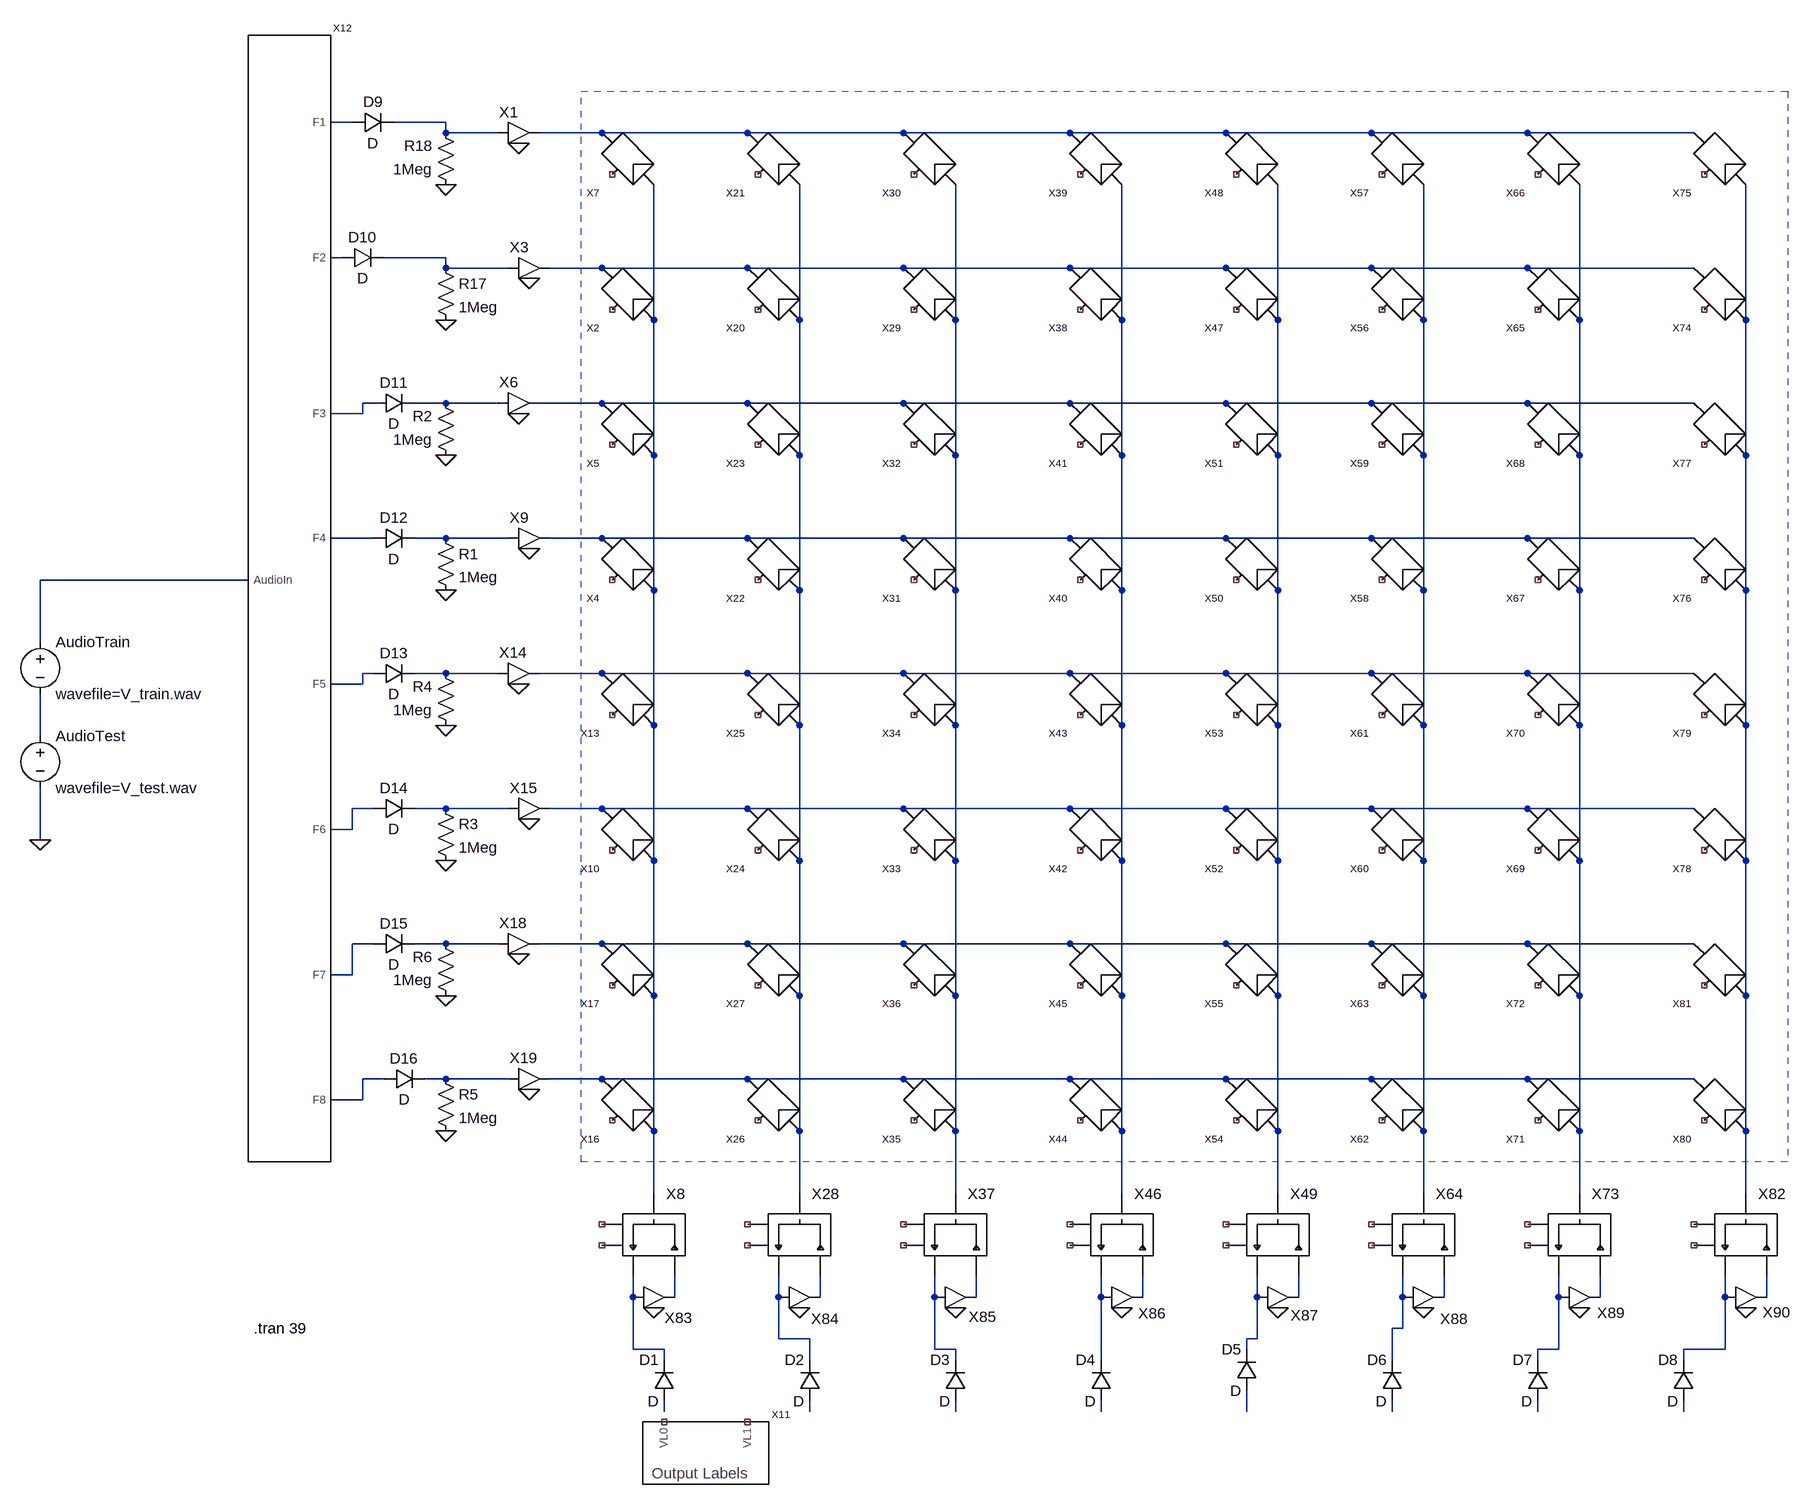
[diagram p0: schematic Net Array.asc]
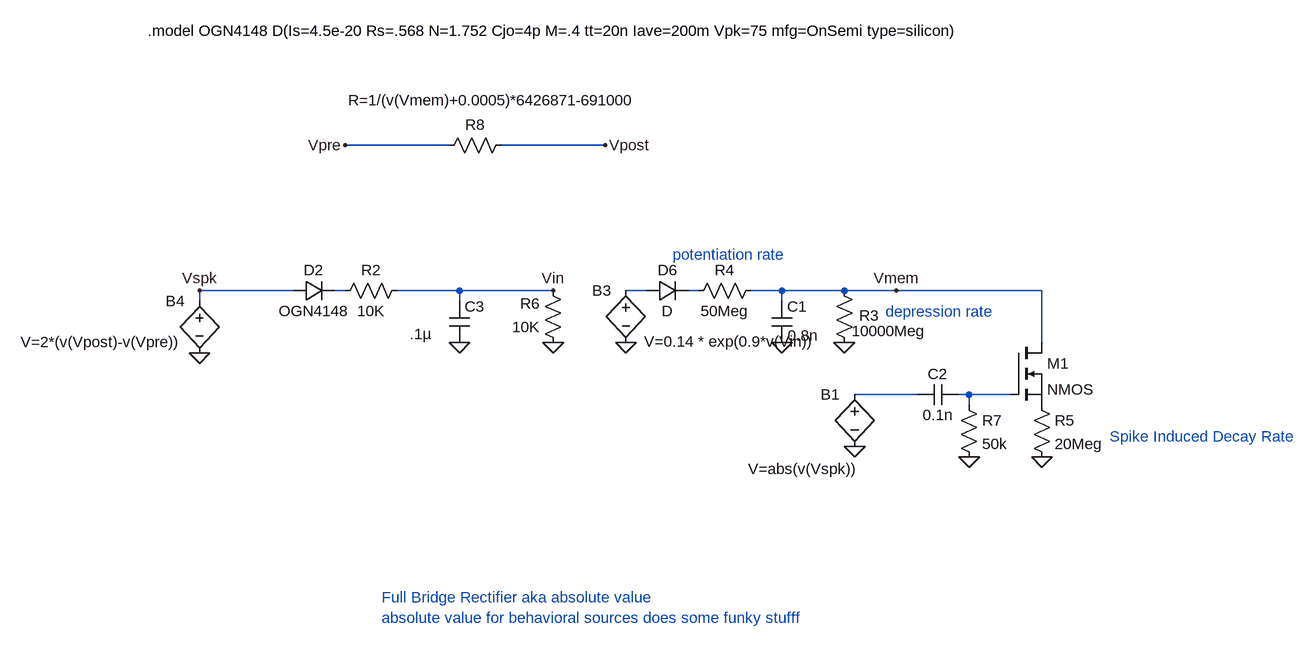
[diagram p1: sub-circuit synapse.asc]
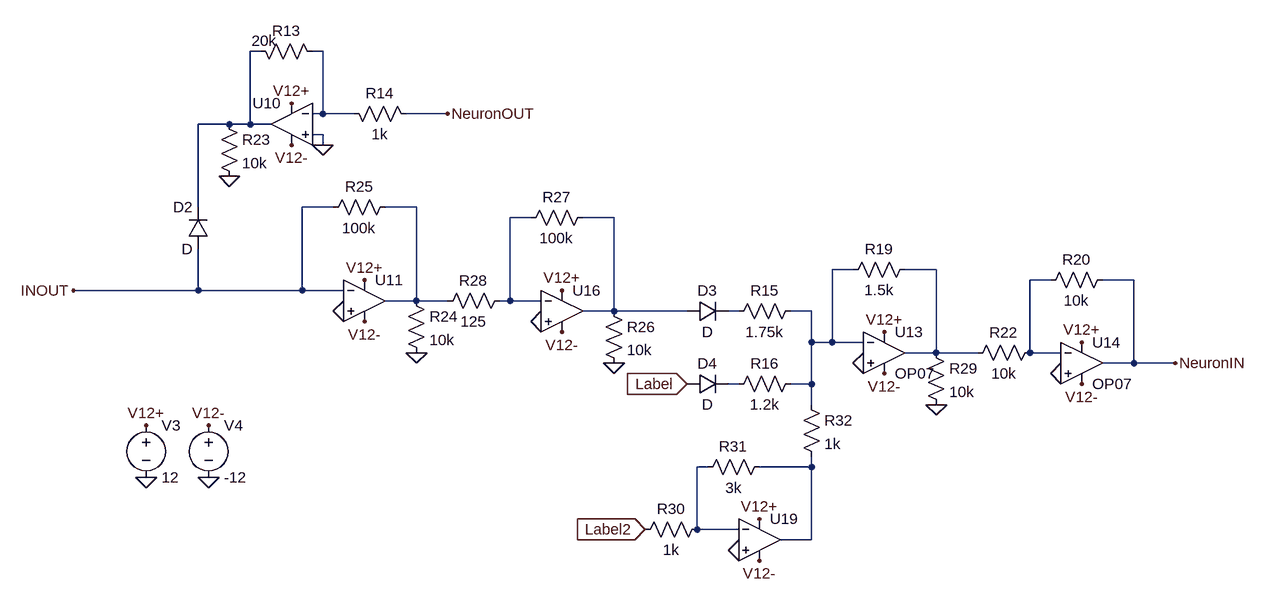
[diagram p2: sub-circuit bidirectionlamp.asc]
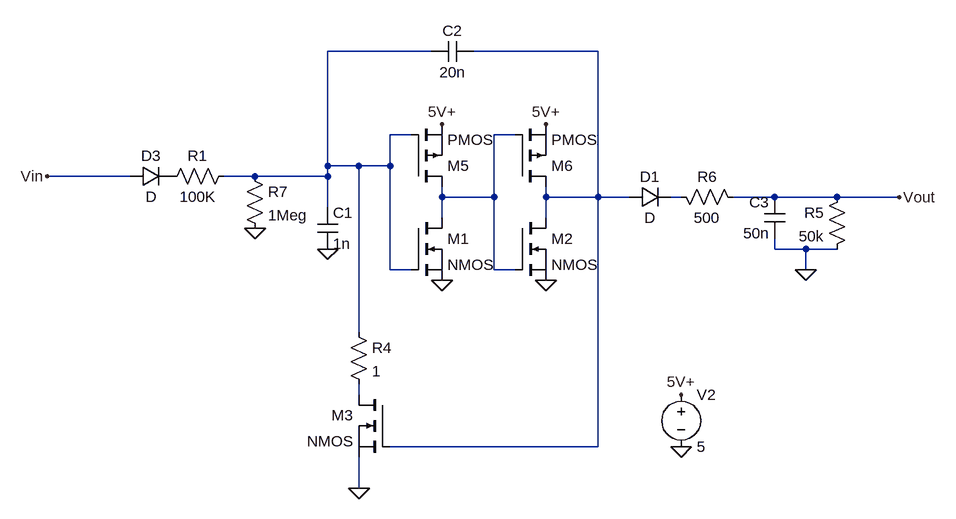
[diagram p3: sub-circuit ahp.asc]
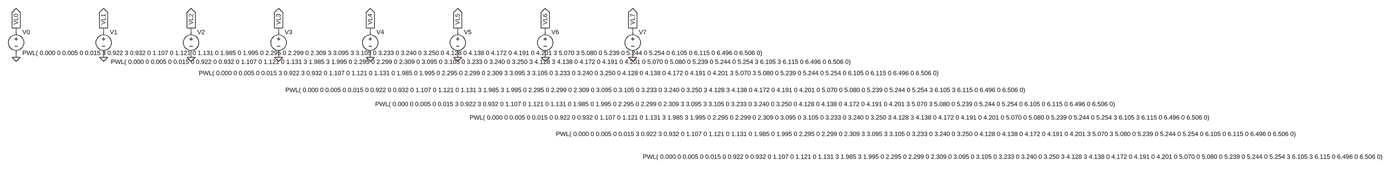
[diagram p4: sub-circuit outputlabels.asc, whole sheet]
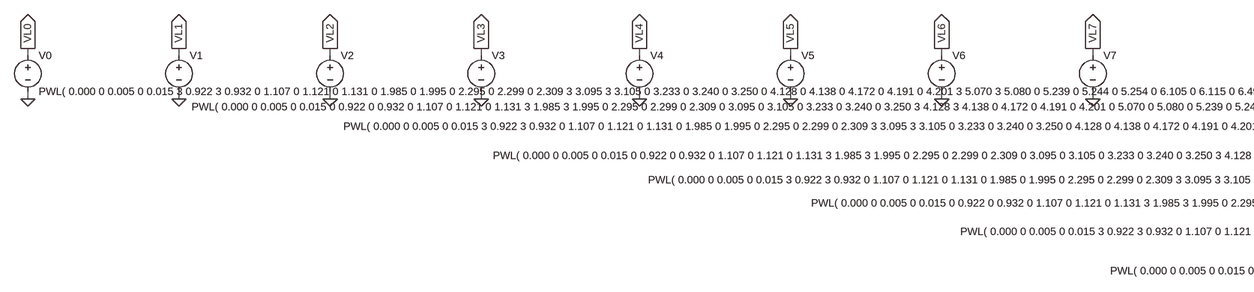
[diagram p5: sub-circuit outputlabels.asc, part, row 1 of 1, column 1 of 2]
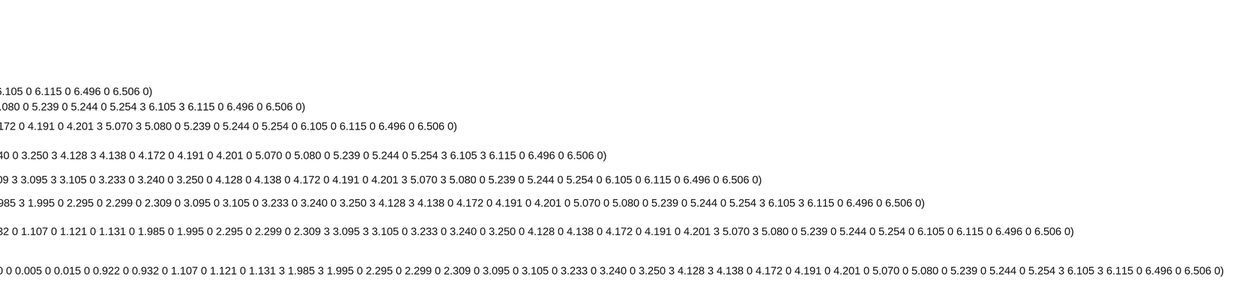
[diagram p6: sub-circuit outputlabels.asc, part, row 1 of 1, column 2 of 2]
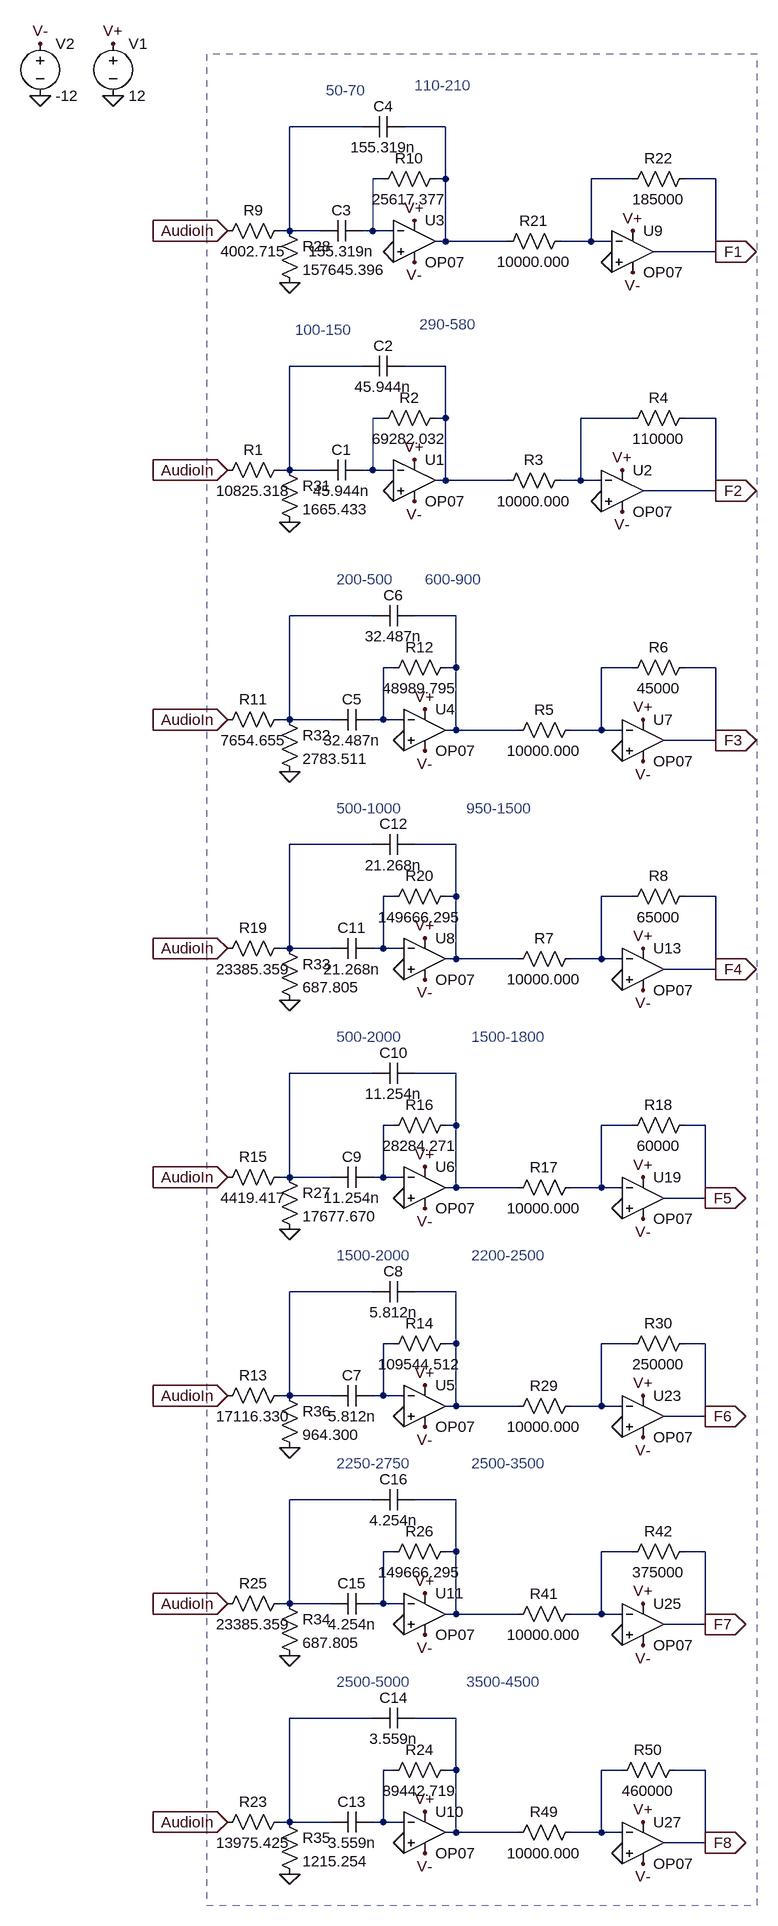
[diagram p7: sub-circuit filterbank.asc]
Net Array.asc, the LTspice schematic file:
Version 4
SHEET 1 2160 1096
WIRE -64 -1024 -96 -1024
WIRE 80 -1024 0 -1024
WIRE 80 -1008 80 -1024
WIRE 160 -1008 80 -1008
WIRE 320 -1008 224 -1008
WIRE 544 -1008 320 -1008
WIRE 784 -1008 544 -1008
WIRE 1040 -1008 784 -1008
WIRE 1280 -1008 1040 -1008
WIRE 1504 -1008 1280 -1008
WIRE 1744 -1008 1504 -1008
WIRE 2000 -1008 1744 -1008
WIRE -80 -816 -96 -816
WIRE 80 -816 -16 -816
WIRE 80 -800 80 -816
WIRE 176 -800 80 -800
WIRE 320 -800 240 -800
WIRE 544 -800 320 -800
WIRE 784 -800 544 -800
WIRE 1040 -800 784 -800
WIRE 1280 -800 1040 -800
WIRE 1504 -800 1280 -800
WIRE 1744 -800 1504 -800
WIRE 2000 -800 1744 -800
WIRE 400 -720 400 -928
WIRE 624 -720 624 -928
WIRE 864 -720 864 -928
WIRE 1120 -720 1120 -928
WIRE 1360 -720 1360 -928
WIRE 1584 -720 1584 -928
WIRE 1824 -720 1824 -928
WIRE 2080 -720 2080 -928
WIRE -32 -592 -48 -592
WIRE 80 -592 32 -592
WIRE 160 -592 80 -592
WIRE 320 -592 224 -592
WIRE 544 -592 320 -592
WIRE 784 -592 544 -592
WIRE 1040 -592 784 -592
WIRE 1280 -592 1040 -592
WIRE 1504 -592 1280 -592
WIRE 1744 -592 1504 -592
WIRE 2000 -592 1744 -592
WIRE -48 -576 -48 -592
WIRE -48 -576 -96 -576
WIRE 400 -512 400 -720
WIRE 624 -512 624 -720
WIRE 864 -512 864 -720
WIRE 1120 -512 1120 -720
WIRE 1360 -512 1360 -720
WIRE 1584 -512 1584 -720
WIRE 1824 -512 1824 -720
WIRE 2080 -512 2080 -720
WIRE -32 -384 -96 -384
WIRE 80 -384 32 -384
WIRE 176 -384 80 -384
WIRE 320 -384 240 -384
WIRE 544 -384 320 -384
WIRE 784 -384 544 -384
WIRE 1040 -384 784 -384
WIRE 1280 -384 1040 -384
WIRE 1504 -384 1280 -384
WIRE 1744 -384 1504 -384
WIRE 2000 -384 1744 -384
WIRE -224 -320 -544 -320
WIRE 400 -304 400 -512
WIRE 624 -304 624 -512
WIRE 864 -304 864 -512
WIRE 1120 -304 1120 -512
WIRE 1360 -304 1360 -512
WIRE 1584 -304 1584 -512
WIRE 1824 -304 1824 -512
WIRE 2080 -304 2080 -512
WIRE -544 -224 -544 -320
WIRE -32 -176 -48 -176
WIRE 80 -176 32 -176
WIRE 160 -176 80 -176
WIRE 320 -176 224 -176
WIRE 544 -176 320 -176
WIRE 784 -176 544 -176
WIRE 1040 -176 784 -176
WIRE 1280 -176 1040 -176
WIRE 1504 -176 1280 -176
WIRE 1744 -176 1504 -176
WIRE 2000 -176 1744 -176
WIRE -48 -160 -48 -176
WIRE -48 -160 -96 -160
WIRE 400 -96 400 -304
WIRE 624 -96 624 -304
WIRE 864 -96 864 -304
WIRE 1120 -96 1120 -304
WIRE 1360 -96 1360 -304
WIRE 1584 -96 1584 -304
WIRE 1824 -96 1824 -304
WIRE 2080 -96 2080 -304
WIRE -544 -80 -544 -144
WIRE -32 32 -64 32
WIRE 80 32 32 32
WIRE 176 32 80 32
WIRE 320 32 240 32
WIRE 544 32 320 32
WIRE 784 32 544 32
WIRE 1040 32 784 32
WIRE 1280 32 1040 32
WIRE 1504 32 1280 32
WIRE 1744 32 1504 32
WIRE 2000 32 1744 32
WIRE -64 64 -64 32
WIRE -64 64 -96 64
WIRE -544 80 -544 0
WIRE 400 112 400 -96
WIRE 624 112 624 -96
WIRE 864 112 864 -96
WIRE 1120 112 1120 -96
WIRE 1360 112 1360 -96
WIRE 1584 112 1584 -96
WIRE 1824 112 1824 -96
WIRE 2080 112 2080 -96
WIRE -32 240 -64 240
WIRE 80 240 32 240
WIRE 160 240 80 240
WIRE 320 240 224 240
WIRE 544 240 320 240
WIRE 784 240 544 240
WIRE 1040 240 784 240
WIRE 1280 240 1040 240
WIRE 1504 240 1280 240
WIRE 1744 240 1504 240
WIRE 2000 240 1744 240
WIRE -64 288 -64 240
WIRE -64 288 -96 288
WIRE 400 320 400 112
WIRE 624 320 624 112
WIRE 864 320 864 112
WIRE 1120 320 1120 112
WIRE 1360 320 1360 112
WIRE 1584 320 1584 112
WIRE 1824 320 1824 112
WIRE 2080 320 2080 112
WIRE -16 448 -48 448
WIRE 80 448 48 448
WIRE 176 448 80 448
WIRE 320 448 240 448
WIRE 544 448 320 448
WIRE 784 448 544 448
WIRE 1040 448 784 448
WIRE 1280 448 1040 448
WIRE 1504 448 1280 448
WIRE 1744 448 1504 448
WIRE 2000 448 1744 448
WIRE -48 480 -48 448
WIRE -48 480 -96 480
WIRE 400 528 400 320
WIRE 624 528 624 320
WIRE 864 528 864 320
WIRE 1120 528 1120 320
WIRE 1360 528 1360 320
WIRE 1584 528 1584 320
WIRE 1824 528 1824 320
WIRE 2080 528 2080 320
WIRE 400 624 400 528
WIRE 624 624 624 528
WIRE 864 624 864 528
WIRE 1120 624 1120 528
WIRE 1360 624 1360 528
WIRE 1584 624 1584 528
WIRE 1824 624 1824 528
WIRE 2080 624 2080 528
WIRE 368 784 368 752
WIRE 432 784 432 752
WIRE 592 784 592 752
WIRE 656 784 656 752
WIRE 832 784 832 752
WIRE 896 784 896 752
WIRE 1088 784 1088 752
WIRE 1152 784 1152 752
WIRE 1328 784 1328 752
WIRE 1392 784 1392 752
WIRE 1552 784 1552 752
WIRE 1616 784 1616 752
WIRE 1792 784 1792 752
WIRE 1856 784 1856 752
WIRE 2048 784 2048 752
WIRE 2112 784 2112 752
WIRE 1552 832 1552 784
WIRE 1552 832 1536 832
WIRE 592 848 592 784
WIRE 640 848 592 848
WIRE 1328 848 1328 784
WIRE 1328 848 1312 848
WIRE 368 864 368 784
WIRE 416 864 368 864
WIRE 832 864 832 784
WIRE 864 864 832 864
WIRE 1312 864 1312 848
WIRE 1792 864 1792 784
WIRE 1792 864 1760 864
WIRE 2048 864 2048 784
WIRE 2048 864 1984 864
WIRE 416 880 416 864
WIRE 640 880 640 848
WIRE 864 880 864 864
WIRE 1088 880 1088 784
WIRE 1536 880 1536 832
WIRE 1760 880 1760 864
WIRE 1984 880 1984 864
WIRE 416 960 416 944
WIRE 640 960 640 944
WIRE 864 960 864 944
WIRE 1088 960 1088 944
WIRE 1312 960 1312 928
WIRE 1536 960 1536 944
WIRE 1760 960 1760 944
WIRE 1984 960 1984 944
FLAG 80 -720 0
FLAG 80 -928 0
FLAG 192 -992 0
FLAG 208 -784 0
FLAG 80 -304 0
FLAG 80 -512 0
FLAG 192 -576 0
FLAG 208 -368 0
FLAG 80 112 0
FLAG 80 -96 0
FLAG 192 -160 0
FLAG 208 48 0
FLAG 80 528 0
FLAG 80 320 0
FLAG 192 256 0
FLAG 208 464 0
FLAG 400 800 0
FLAG 624 800 0
FLAG 864 800 0
FLAG 1120 800 0
FLAG 1360 800 0
FLAG 1584 800 0
FLAG 1824 800 0
FLAG 2080 800 0
FLAG -544 80 0
SYMBOL Synapse 400 -720 R180
SYMATTR InstName X2
SYMBOL Synapse 400 -928 R180
SYMATTR InstName X7
SYMBOL res 64 -816 R0
SYMATTR InstName R17
SYMATTR Value 1Meg
SYMBOL res 96 -912 R180
WINDOW 0 36 76 Left 2
WINDOW 3 36 40 Left 2
SYMATTR InstName R18
SYMATTR Value 1Meg
SYMBOL BiDirectionlAmp 400 688 R0
SYMATTR InstName X8
SYMBOL AHP 160 -1008 R0
SYMATTR InstName X1
SYMATTR SpiceLine Rinhibition = 1Meg
SYMBOL AHP 176 -800 R0
SYMATTR InstName X3
SYMATTR SpiceLine Rinhibition = 1Meg
SYMBOL Synapse 400 -304 R180
SYMATTR InstName X4
SYMBOL Synapse 400 -512 R180
SYMATTR InstName X5
SYMBOL res 64 -400 R0
SYMATTR InstName R1
SYMATTR Value 1Meg
SYMBOL res 96 -496 R180
WINDOW 0 36 76 Left 2
WINDOW 3 36 40 Left 2
SYMATTR InstName R2
SYMATTR Value 1Meg
SYMBOL AHP 160 -592 R0
SYMATTR InstName X6
SYMATTR SpiceLine Rinhibition = 1Meg
SYMBOL AHP 176 -384 R0
SYMATTR InstName X9
SYMATTR SpiceLine Rinhibition = 1Meg
SYMBOL Synapse 400 112 R180
SYMATTR InstName X10
SYMBOL Synapse 400 -96 R180
SYMATTR InstName X13
SYMBOL res 64 16 R0
SYMATTR InstName R3
SYMATTR Value 1Meg
SYMBOL res 96 -80 R180
WINDOW 0 36 76 Left 2
WINDOW 3 36 40 Left 2
SYMATTR InstName R4
SYMATTR Value 1Meg
SYMBOL AHP 160 -176 R0
SYMATTR InstName X14
SYMATTR SpiceLine Rinhibition = 1Meg
SYMBOL AHP 176 32 R0
SYMATTR InstName X15
SYMATTR SpiceLine Rinhibition = 1Meg
SYMBOL Synapse 400 528 R180
SYMATTR InstName X16
SYMBOL Synapse 400 320 R180
SYMATTR InstName X17
SYMBOL res 64 432 R0
SYMATTR InstName R5
SYMATTR Value 1Meg
SYMBOL res 96 336 R180
WINDOW 0 36 76 Left 2
WINDOW 3 36 40 Left 2
SYMATTR InstName R6
SYMATTR Value 1Meg
SYMBOL AHP 160 240 R0
SYMATTR InstName X18
SYMATTR SpiceLine Rinhibition = 1Meg
SYMBOL AHP 176 448 R0
SYMATTR InstName X19
SYMATTR SpiceLine Rinhibition = 1Meg
SYMBOL Synapse 624 -720 R180
SYMATTR InstName X20
SYMBOL Synapse 624 -928 R180
SYMATTR InstName X21
SYMBOL Synapse 624 -304 R180
SYMATTR InstName X22
SYMBOL Synapse 624 -512 R180
SYMATTR InstName X23
SYMBOL Synapse 624 112 R180
SYMATTR InstName X24
SYMBOL Synapse 624 -96 R180
SYMATTR InstName X25
SYMBOL Synapse 624 528 R180
SYMATTR InstName X26
SYMBOL Synapse 624 320 R180
SYMATTR InstName X27
SYMBOL BiDirectionlAmp 624 688 R0
SYMATTR InstName X28
SYMBOL Synapse 864 -720 R180
SYMATTR InstName X29
SYMBOL Synapse 864 -928 R180
SYMATTR InstName X30
SYMBOL Synapse 864 -304 R180
SYMATTR InstName X31
SYMBOL Synapse 864 -512 R180
SYMATTR InstName X32
SYMBOL Synapse 864 112 R180
SYMATTR InstName X33
SYMBOL Synapse 864 -96 R180
SYMATTR InstName X34
SYMBOL Synapse 864 528 R180
SYMATTR InstName X35
SYMBOL Synapse 864 320 R180
SYMATTR InstName X36
SYMBOL BiDirectionlAmp 864 688 R0
SYMATTR InstName X37
SYMBOL Synapse 1120 -720 R180
SYMATTR InstName X38
SYMBOL Synapse 1120 -928 R180
SYMATTR InstName X39
SYMBOL Synapse 1120 -304 R180
SYMATTR InstName X40
SYMBOL Synapse 1120 -512 R180
SYMATTR InstName X41
SYMBOL Synapse 1120 112 R180
SYMATTR InstName X42
SYMBOL Synapse 1120 -96 R180
SYMATTR InstName X43
SYMBOL Synapse 1120 528 R180
SYMATTR InstName X44
SYMBOL Synapse 1120 320 R180
SYMATTR InstName X45
SYMBOL BiDirectionlAmp 1120 688 R0
SYMATTR InstName X46
SYMBOL Synapse 1360 -720 R180
SYMATTR InstName X47
SYMBOL Synapse 1360 -928 R180
SYMATTR InstName X48
SYMBOL BiDirectionlAmp 1360 688 R0
SYMATTR InstName X49
SYMBOL Synapse 1360 -304 R180
SYMATTR InstName X50
SYMBOL Synapse 1360 -512 R180
SYMATTR InstName X51
SYMBOL Synapse 1360 112 R180
SYMATTR InstName X52
SYMBOL Synapse 1360 -96 R180
SYMATTR InstName X53
SYMBOL Synapse 1360 528 R180
SYMATTR InstName X54
SYMBOL Synapse 1360 320 R180
SYMATTR InstName X55
SYMBOL Synapse 1584 -720 R180
SYMATTR InstName X56
SYMBOL Synapse 1584 -928 R180
SYMATTR InstName X57
SYMBOL Synapse 1584 -304 R180
SYMATTR InstName X58
SYMBOL Synapse 1584 -512 R180
SYMATTR InstName X59
SYMBOL Synapse 1584 112 R180
SYMATTR InstName X60
SYMBOL Synapse 1584 -96 R180
SYMATTR InstName X61
SYMBOL Synapse 1584 528 R180
SYMATTR InstName X62
SYMBOL Synapse 1584 320 R180
SYMATTR InstName X63
SYMBOL BiDirectionlAmp 1584 688 R0
SYMATTR InstName X64
SYMBOL Synapse 1824 -720 R180
SYMATTR InstName X65
SYMBOL Synapse 1824 -928 R180
SYMATTR InstName X66
SYMBOL Synapse 1824 -304 R180
SYMATTR InstName X67
SYMBOL Synapse 1824 -512 R180
SYMATTR InstName X68
SYMBOL Synapse 1824 112 R180
SYMATTR InstName X69
SYMBOL Synapse 1824 -96 R180
SYMATTR InstName X70
SYMBOL Synapse 1824 528 R180
SYMATTR InstName X71
SYMBOL Synapse 1824 320 R180
SYMATTR InstName X72
SYMBOL BiDirectionlAmp 1824 688 R0
SYMATTR InstName X73
SYMBOL Synapse 2080 -720 R180
SYMATTR InstName X74
SYMBOL Synapse 2080 -928 R180
SYMATTR InstName X75
SYMBOL Synapse 2080 -304 R180
SYMATTR InstName X76
SYMBOL Synapse 2080 -512 R180
SYMATTR InstName X77
SYMBOL Synapse 2080 112 R180
SYMATTR InstName X78
SYMBOL Synapse 2080 -96 R180
SYMATTR InstName X79
SYMBOL Synapse 2080 528 R180
SYMATTR InstName X80
SYMBOL Synapse 2080 320 R180
SYMATTR InstName X81
SYMBOL BiDirectionlAmp 2080 688 R0
SYMATTR InstName X82
SYMBOL AHP 368 784 R0
WINDOW 0 49 32 Left 2
SYMATTR InstName X83
SYMATTR SpiceLine Rinhibition = 1Meg
SYMBOL AHP 592 784 R0
WINDOW 0 50 33 Left 2
SYMATTR InstName X84
SYMATTR SpiceLine Rinhibition = 1Meg
SYMBOL AHP 832 784 R0
WINDOW 0 52 30 Left 2
SYMATTR InstName X85
SYMATTR SpiceLine Rinhibition = 1Meg
SYMBOL AHP 1088 784 R0
WINDOW 0 57 25 Left 2
SYMATTR InstName X86
SYMATTR SpiceLine Rinhibition = 1Meg
SYMBOL AHP 1328 784 R0
WINDOW 0 52 28 Left 2
SYMATTR InstName X87
SYMATTR SpiceLine Rinhibition = 1Meg
SYMBOL AHP 1552 784 R0
WINDOW 0 58 33 Left 2
SYMATTR InstName X88
SYMATTR SpiceLine Rinhibition = 1Meg
SYMBOL AHP 1792 784 R0
WINDOW 0 59 24 Left 2
SYMATTR InstName X89
SYMATTR SpiceLine Rinhibition = 1Meg
SYMBOL AHP 2048 784 R0
WINDOW 0 58 23 Left 2
SYMATTR InstName X90
SYMATTR SpiceLine Rinhibition = 1Meg
SYMBOL OutputLabels 384 1072 R0
SYMATTR InstName X11
SYMBOL voltage -544 -240 R0
SYMATTR InstName AudioTrain
SYMATTR Value wavefile=V_train.wav
SYMBOL voltage -544 -96 R0
SYMATTR InstName AudioTest
SYMATTR Value wavefile=V_test.wav
SYMBOL FilterBank -224 576 R0
SYMATTR InstName X12
SYMBOL diode 432 944 R180
WINDOW 0 24 64 Left 2
WINDOW 3 24 0 Left 2
SYMATTR InstName D1
SYMBOL diode 656 944 R180
WINDOW 0 24 64 Left 2
WINDOW 3 24 0 Left 2
SYMATTR InstName D2
SYMBOL diode 880 944 R180
WINDOW 0 24 64 Left 2
WINDOW 3 24 0 Left 2
SYMATTR InstName D3
SYMBOL diode 1104 944 R180
WINDOW 0 24 64 Left 2
WINDOW 3 24 0 Left 2
SYMATTR InstName D4
SYMBOL diode 1328 928 R180
WINDOW 0 24 64 Left 2
WINDOW 3 24 0 Left 2
SYMATTR InstName D5
SYMBOL diode 1552 944 R180
WINDOW 0 24 64 Left 2
WINDOW 3 24 0 Left 2
SYMATTR InstName D6
SYMBOL diode 1776 944 R180
WINDOW 0 24 64 Left 2
WINDOW 3 24 0 Left 2
SYMATTR InstName D7
SYMBOL diode 2000 944 R180
WINDOW 0 24 64 Left 2
WINDOW 3 24 0 Left 2
SYMATTR InstName D8
SYMBOL diode -64 -1008 R270
WINDOW 0 32 32 VTop 2
WINDOW 3 0 32 VBottom 2
SYMATTR InstName D9
SYMBOL diode -80 -800 R270
WINDOW 0 32 32 VTop 2
WINDOW 3 0 32 VBottom 2
SYMATTR InstName D10
SYMBOL diode -32 -576 R270
WINDOW 0 32 32 VTop 2
WINDOW 3 0 32 VBottom 2
SYMATTR InstName D11
SYMBOL diode -32 -368 R270
WINDOW 0 32 32 VTop 2
WINDOW 3 0 32 VBottom 2
SYMATTR InstName D12
SYMBOL diode -32 -160 R270
WINDOW 0 32 32 VTop 2
WINDOW 3 0 32 VBottom 2
SYMATTR InstName D13
SYMBOL diode -32 48 R270
WINDOW 0 32 32 VTop 2
WINDOW 3 0 32 VBottom 2
SYMATTR InstName D14
SYMBOL diode -32 256 R270
WINDOW 0 32 32 VTop 2
WINDOW 3 0 32 VBottom 2
SYMATTR InstName D15
SYMBOL diode -16 464 R270
WINDOW 0 32 32 VTop 2
WINDOW 3 0 32 VBottom 2
SYMATTR InstName D16
TEXT -216 832 Left 2 !.tran 39
RECTANGLE Normal 2144 576 288 -1072 2

The netlist it stands for:
* Net Array.asc
XX2 N007 N006 NC_01 synapse
XX7 N007 N003 NC_02 synapse
R17 N005 0 1Meg
R18 0 N002 1Meg
XX8 N007 N035 N036 NC_03 NC_04 bidirectionlamp
XX1 N002 N003 0 ahp params: AHP Rinhibition = 1Meg
XX3 N005 N006 0 ahp params: AHP Rinhibition = 1Meg
XX4 N007 N020 NC_05 synapse
XX5 N007 N017 NC_06 synapse
R1 N019 0 1Meg
R2 0 N016 1Meg
XX6 N016 N017 0 ahp params: AHP Rinhibition = 1Meg
XX9 N019 N020 0 ahp params: AHP Rinhibition = 1Meg
XX10 N007 N028 NC_07 synapse
XX13 N007 N024 NC_08 synapse
R3 N027 0 1Meg
R4 0 N023 1Meg
XX14 N023 N024 0 ahp params: AHP Rinhibition = 1Meg
XX15 N027 N028 0 ahp params: AHP Rinhibition = 1Meg
XX16 N007 N034 NC_09 synapse
XX17 N007 N031 NC_10 synapse
R5 N033 0 1Meg
R6 0 N030 1Meg
XX18 N030 N031 0 ahp params: AHP Rinhibition = 1Meg
XX19 N033 N034 0 ahp params: AHP Rinhibition = 1Meg
XX20 N008 N006 NC_11 synapse
XX21 N008 N003 NC_12 synapse
XX22 N008 N020 NC_13 synapse
XX23 N008 N017 NC_14 synapse
XX24 N008 N028 NC_15 synapse
XX25 N008 N024 NC_16 synapse
XX26 N008 N034 NC_17 synapse
XX27 N008 N031 NC_18 synapse
XX28 N008 N037 N038 NC_19 NC_20 bidirectionlamp
XX29 N009 N006 NC_21 synapse
XX30 N009 N003 NC_22 synapse
XX31 N009 N020 NC_23 synapse
XX32 N009 N017 NC_24 synapse
XX33 N009 N028 NC_25 synapse
XX34 N009 N024 NC_26 synapse
XX35 N009 N034 NC_27 synapse
XX36 N009 N031 NC_28 synapse
XX37 N009 N039 N040 NC_29 NC_30 bidirectionlamp
XX38 N010 N006 NC_31 synapse
XX39 N010 N003 NC_32 synapse
XX40 N010 N020 NC_33 synapse
XX41 N010 N017 NC_34 synapse
XX42 N010 N028 NC_35 synapse
XX43 N010 N024 NC_36 synapse
XX44 N010 N034 NC_37 synapse
XX45 N010 N031 NC_38 synapse
XX46 N010 N041 N042 NC_39 NC_40 bidirectionlamp
XX47 N011 N006 NC_41 synapse
XX48 N011 N003 NC_42 synapse
XX49 N011 N043 N044 NC_43 NC_44 bidirectionlamp
XX50 N011 N020 NC_45 synapse
XX51 N011 N017 NC_46 synapse
XX52 N011 N028 NC_47 synapse
XX53 N011 N024 NC_48 synapse
XX54 N011 N034 NC_49 synapse
XX55 N011 N031 NC_50 synapse
XX56 N012 N006 NC_51 synapse
XX57 N012 N003 NC_52 synapse
XX58 N012 N020 NC_53 synapse
XX59 N012 N017 NC_54 synapse
XX60 N012 N028 NC_55 synapse
XX61 N012 N024 NC_56 synapse
XX62 N012 N034 NC_57 synapse
XX63 N012 N031 NC_58 synapse
XX64 N012 N045 N046 NC_59 NC_60 bidirectionlamp
XX65 N013 N006 NC_61 synapse
XX66 N013 N003 NC_62 synapse
XX67 N013 N020 NC_63 synapse
XX68 N013 N017 NC_64 synapse
XX69 N013 N028 NC_65 synapse
XX70 N013 N024 NC_66 synapse
XX71 N013 N034 NC_67 synapse
XX72 N013 N031 NC_68 synapse
XX73 N013 N047 N048 NC_69 NC_70 bidirectionlamp
XX74 N014 N006 NC_71 synapse
XX75 N014 N003 NC_72 synapse
XX76 N014 N020 NC_73 synapse
XX77 N014 N017 NC_74 synapse
XX78 N014 N028 NC_75 synapse
XX79 N014 N024 NC_76 synapse
XX80 N014 N034 NC_77 synapse
XX81 N014 N031 NC_78 synapse
XX82 N014 N049 N050 NC_79 NC_80 bidirectionlamp
XX83 N035 N036 0 ahp params: AHP Rinhibition = 1Meg
XX84 N037 N038 0 ahp params: AHP Rinhibition = 1Meg
XX85 N039 N040 0 ahp params: AHP Rinhibition = 1Meg
XX86 N041 N042 0 ahp params: AHP Rinhibition = 1Meg
XX87 N043 N044 0 ahp params: AHP Rinhibition = 1Meg
XX88 N045 N046 0 ahp params: AHP Rinhibition = 1Meg
XX89 N047 N048 0 ahp params: AHP Rinhibition = 1Meg
XX90 N049 N050 0 ahp params: AHP Rinhibition = 1Meg
XX11 NC_81 NC_82 outputlabels
V§AudioTrain N021 N025 wavefile=V_train.wav
V§AudioTest N025 0 wavefile=V_test.wav
XX12 N001 N004 N015 N018 N022 N026 N029 N032 N021 filterbank
D1 N051 N035 D
D2 N052 N037 D
D3 N053 N039 D
D4 N054 N041 D
D5 N055 N043 D
D6 N056 N045 D
D7 N057 N047 D
D8 N058 N049 D
D9 N001 N002 D
D10 N004 N005 D
D11 N015 N016 D
D12 N018 N019 D
D13 N022 N023 D
D14 N026 N027 D
D15 N029 N030 D
D16 N032 N033 D

* block symbol definitions
.subckt synapse Vpre Vpost Vmem
R6 0 Vin 10K
B4 Vspk 0 V=2*(v(Vpost)-v(Vpre))
R8 Vpost Vpre R=1/(v(Vmem)+0.0005)*6426871-691000
C3 Vin 0 .1µ V=16 Irms=7.41 Rser=0.000 Lser=0
D2 Vspk N001 OGN4148
R2 Vin N001 10K
B1 N004 0 V=abs(v(Vspk))
C1 Vmem 0 0.8n V=16 Irms=7.41 Rser=0.000 Lser=0
R3 0 Vmem 10000Meg
R4 Vmem N003 50Meg
B3 N002 0 V=0.14 * exp(0.9*v(Vin))
M1 Vmem N005 P001 P001 NMOS
R5 P001 0 20Meg
C2 N005 N004 0.1n
R7 N005 0 50k
D6 N002 N003 D
.model OGN4148 D(Is=4.5e-20 Rs=.568 N=1.752 Cjo=4p M=.4 tt=20n Iave=200m Vpk=75 mfg=OnSemi type=silicon)
* potentiation rate
* depression rate
* Spike Induced Decay Rate
* Full Bridge Rectifier aka absolute value
* absolute value for behavioral sources does some funky stufff
.ends synapse

.subckt bidirectionlamp INOUT NeuronIN NeuronOUT Label Label2
V3 V12+ 0 12
V4 V12- 0 -12
XU10 0 N002 V12+ V12- N001 level.2 Avol=1Meg GBW=10Meg Slew=10Meg ilimit=25m rail=0 Vos=0 phimargin=45 en=0 enk=0 in=0 ink=0 Rin=500Meg  ; pins IN+ IN- V+ V- OUT
R13 N001 N002 20k
R14 N002 NeuronOUT 1k
XU11 0 INOUT V12+ V12- N003 level.2 Avol=1Meg GBW=10Meg Slew=10Meg ilimit=25m rail=0 Vos=0 phimargin=45 en=0 enk=0 in=0 ink=0 Rin=500Meg  ; pins IN+ IN- V+ V- OUT
D2 INOUT N001 D
D3 N005 N009 D
XU13 0 N006 V12+ V12- N007 LT1001  ; OP07, pins In+ In- V+ V- OUT
R15 N006 N009 1.75k
R16 N006 N010 1.2k
R19 N007 N006 1.5k
XU14 0 N008 V12+ V12- NeuronIN LT1001  ; OP07, pins In+ In- V+ V- OUT
R20 NeuronIN N008 10k
R22 N008 N007 10k
D4 Label N010 D
R23 N001 0 10k
R24 N003 0 10k
R25 N003 INOUT 100k
XU16 0 N004 V12+ V12- N005 level.2 Avol=1Meg GBW=10Meg Slew=10Meg ilimit=25m rail=0 Vos=0 phimargin=45 en=0 enk=0 in=0 ink=0 Rin=500Meg  ; pins IN+ IN- V+ V- OUT
R26 N005 0 10k
R27 N005 N004 100k
R28 N004 N003 125
R29 N007 0 10k
XU19 0 N011 V12+ V12- N012 level.2 Avol=1Meg GBW=10Meg Slew=10Meg ilimit=25m rail=0 Vos=0 phimargin=45 en=0 enk=0 in=0 ink=0 Rin=500Meg  ; pins IN+ IN- V+ V- OUT
R30 N011 Label2 1k
R31 N012 N011 3k
R32 N006 N012 1k
.ends bidirectionlamp

.subckt ahp Vin Vout 5V+
R1 N001 P001 100K
C1 N001 0 1n
C2 N002 N001 20n
V2 5V+ 0 5
M3 N005 N002 0 0 NMOS
M1 N003 N001 0 0 NMOS
M2 N002 N003 0 0 NMOS
M5 N003 N001 5V+ 5V+ PMOS
M6 N002 N003 5V+ 5V+ PMOS
D3 Vin P001 D
R4 N001 N005 1
R5 Vout 0 50k
C3 Vout 0 50n
R6 N004 Vout 500
D1 N002 N004 D
R7 N001 0 1Meg
.ends ahp

.subckt outputlabels VL0 VL1
V0 VL0 0 PWL( 0.000 0 0.005 0 0.015 3 0.922 3 0.932 0 1.107 0 1.121 0 1.131 0 1.985 0 1.995 0 2.295 0 2.299 0 2.309 3 3.095 3 3.105 0 3.233 0 3.240 0 3.250 0 4.128 0 4.138 0 4.172 0 4.191 0 4.201 3 5.070 3 5.080 0 5.239 0 5.244 0 5.254 0 6.105 0 6.115 0 6.496 0 6.506 0)
V1 VL1 0 PWL( 0.000 0 0.005 0 0.015 0 0.922 0 0.932 0 1.107 0 1.121 0 1.131 3 1.985 3 1.995 0 2.295 0 2.299 0 2.309 0 3.095 0 3.105 0 3.233 0 3.240 0 3.250 3 4.128 3 4.138 0 4.172 0 4.191 0 4.201 0 5.070 0 5.080 0 5.239 0 5.244 0 5.254 3 6.105 3 6.115 0 6.496 0 6.506 0)
V2 VL2 0 PWL( 0.000 0 0.005 0 0.015 3 0.922 3 0.932 0 1.107 0 1.121 0 1.131 0 1.985 0 1.995 0 2.295 0 2.299 0 2.309 3 3.095 3 3.105 0 3.233 0 3.240 0 3.250 0 4.128 0 4.138 0 4.172 0 4.191 0 4.201 3 5.070 3 5.080 0 5.239 0 5.244 0 5.254 0 6.105 0 6.115 0 6.496 0 6.506 0)
V3 VL3 0 PWL( 0.000 0 0.005 0 0.015 0 0.922 0 0.932 0 1.107 0 1.121 0 1.131 3 1.985 3 1.995 0 2.295 0 2.299 0 2.309 0 3.095 0 3.105 0 3.233 0 3.240 0 3.250 3 4.128 3 4.138 0 4.172 0 4.191 0 4.201 0 5.070 0 5.080 0 5.239 0 5.244 0 5.254 3 6.105 3 6.115 0 6.496 0 6.506 0)
V4 VL4 0 PWL( 0.000 0 0.005 0 0.015 3 0.922 3 0.932 0 1.107 0 1.121 0 1.131 0 1.985 0 1.995 0 2.295 0 2.299 0 2.309 3 3.095 3 3.105 0 3.233 0 3.240 0 3.250 0 4.128 0 4.138 0 4.172 0 4.191 0 4.201 3 5.070 3 5.080 0 5.239 0 5.244 0 5.254 0 6.105 0 6.115 0 6.496 0 6.506 0)
V5 VL5 0 PWL( 0.000 0 0.005 0 0.015 0 0.922 0 0.932 0 1.107 0 1.121 0 1.131 3 1.985 3 1.995 0 2.295 0 2.299 0 2.309 0 3.095 0 3.105 0 3.233 0 3.240 0 3.250 3 4.128 3 4.138 0 4.172 0 4.191 0 4.201 0 5.070 0 5.080 0 5.239 0 5.244 0 5.254 3 6.105 3 6.115 0 6.496 0 6.506 0)
V6 VL6 0 PWL( 0.000 0 0.005 0 0.015 3 0.922 3 0.932 0 1.107 0 1.121 0 1.131 0 1.985 0 1.995 0 2.295 0 2.299 0 2.309 3 3.095 3 3.105 0 3.233 0 3.240 0 3.250 0 4.128 0 4.138 0 4.172 0 4.191 0 4.201 3 5.070 3 5.080 0 5.239 0 5.244 0 5.254 0 6.105 0 6.115 0 6.496 0 6.506 0)
V7 VL7 0 PWL( 0.000 0 0.005 0 0.015 0 0.922 0 0.932 0 1.107 0 1.121 0 1.131 3 1.985 3 1.995 0 2.295 0 2.299 0 2.309 0 3.095 0 3.105 0 3.233 0 3.240 0 3.250 3 4.128 3 4.138 0 4.172 0 4.191 0 4.201 0 5.070 0 5.080 0 5.239 0 5.244 0 5.254 3 6.105 3 6.115 0 6.496 0 6.506 0)
.ends outputlabels

.subckt filterbank F1 F2 F3 F4 F5 F6 F7 F8 AudioIn
XU9 0 N004 V+ V- F1 LT1001  ; OP07, pins In+ In- V+ V- OUT
R21 N004 N002 10000.000
R22 F1 N004 185000
XU2 0 N008 V+ V- F2 LT1001  ; OP07, pins In+ In- V+ V- OUT
R3 N008 N006 10000.000
R4 F2 N008 110000
XU7 0 N012 V+ V- F3 LT1001  ; OP07, pins In+ In- V+ V- OUT
R5 N012 N010 10000.000
R6 F3 N012 45000
XU13 0 N016 V+ V- F4 LT1001  ; OP07, pins In+ In- V+ V- OUT
R7 N016 N014 10000.000
R8 F4 N016 65000
XU19 0 N020 V+ V- F5 LT1001  ; OP07, pins In+ In- V+ V- OUT
R17 N020 N018 10000.000
R18 F5 N020 60000
XU23 0 N024 V+ V- F6 LT1001  ; OP07, pins In+ In- V+ V- OUT
R29 N024 N022 10000.000
R30 F6 N024 250000
XU25 0 N028 V+ V- F7 LT1001  ; OP07, pins In+ In- V+ V- OUT
R41 N028 N026 10000.000
R42 F7 N028 375000
XU27 0 N032 V+ V- F8 LT1001  ; OP07, pins In+ In- V+ V- OUT
R49 N032 N030 10000.000
R50 F8 N032 460000
V1 V+ 0 12
V2 V- 0 -12
XU1 0 N007 V+ V- N006 LT1001  ; OP07, pins In+ In- V+ V- OUT
R1 N005 AudioIn 10825.318
C1 N007 N005 45.944n
C2 N006 N005 45.944n
R2 N006 N007 69282.032
XU3 0 N003 V+ V- N002 LT1001  ; OP07, pins In+ In- V+ V- OUT
R9 N001 AudioIn 4002.715
C3 N003 N001 155.319n
C4 N002 N001 155.319n
R10 N002 N003 25617.377
XU4 0 N011 V+ V- N010 LT1001  ; OP07, pins In+ In- V+ V- OUT
R11 N009 AudioIn 7654.655
C5 N011 N009 32.487n
C6 N010 N009 32.487n
R12 N010 N011 48989.795
XU5 0 N023 V+ V- N022 LT1001  ; OP07, pins In+ In- V+ V- OUT
R13 N021 AudioIn 17116.330
C7 N023 N021 5.812n
C8 N022 N021 5.812n
R14 N022 N023 109544.512
XU6 0 N019 V+ V- N018 LT1001  ; OP07, pins In+ In- V+ V- OUT
R15 N017 AudioIn 4419.417
C9 N019 N017 11.254n
C10 N018 N017 11.254n
R16 N018 N019 28284.271
XU8 0 N015 V+ V- N014 LT1001  ; OP07, pins In+ In- V+ V- OUT
R19 N013 AudioIn 23385.359
C11 N015 N013 21.268n
C12 N014 N013 21.268n
R20 N014 N015 149666.295
XU10 0 N031 V+ V- N030 LT1001  ; OP07, pins In+ In- V+ V- OUT
R23 N029 AudioIn 13975.425
C13 N031 N029 3.559n
C14 N030 N029 3.559n
R24 N030 N031 89442.719
XU11 0 N027 V+ V- N026 LT1001  ; OP07, pins In+ In- V+ V- OUT
R25 N025 AudioIn 23385.359
C15 N027 N025 4.254n
C16 N026 N025 4.254n
R26 N026 N027 149666.295
R27 N017 0 17677.670
R28 N001 0 157645.396
R31 N005 0 1665.433
R32 N009 0 2783.511
R33 N013 0 687.805
R34 N025 0 687.805
R35 N029 0 1215.254
R36 N021 0 964.300
* 950-1500
* 1500-1800
* 2200-2500
* 2500-3500
* 3500-4500
* 100-150
* 50-70
* 200-500
* 1500-2000
* 500-2000
* 500-1000
* 2500-5000
* 2250-2750
* 110-210
* 290-580
* 600-900
.ends filterbank

.model D D
.lib standard.dio
.model NMOS NMOS
.model PMOS PMOS
.lib standard.mos
.tran 39
.lib UniversalOpamps2.sub
.lib LTC.lib
.backanno
.end